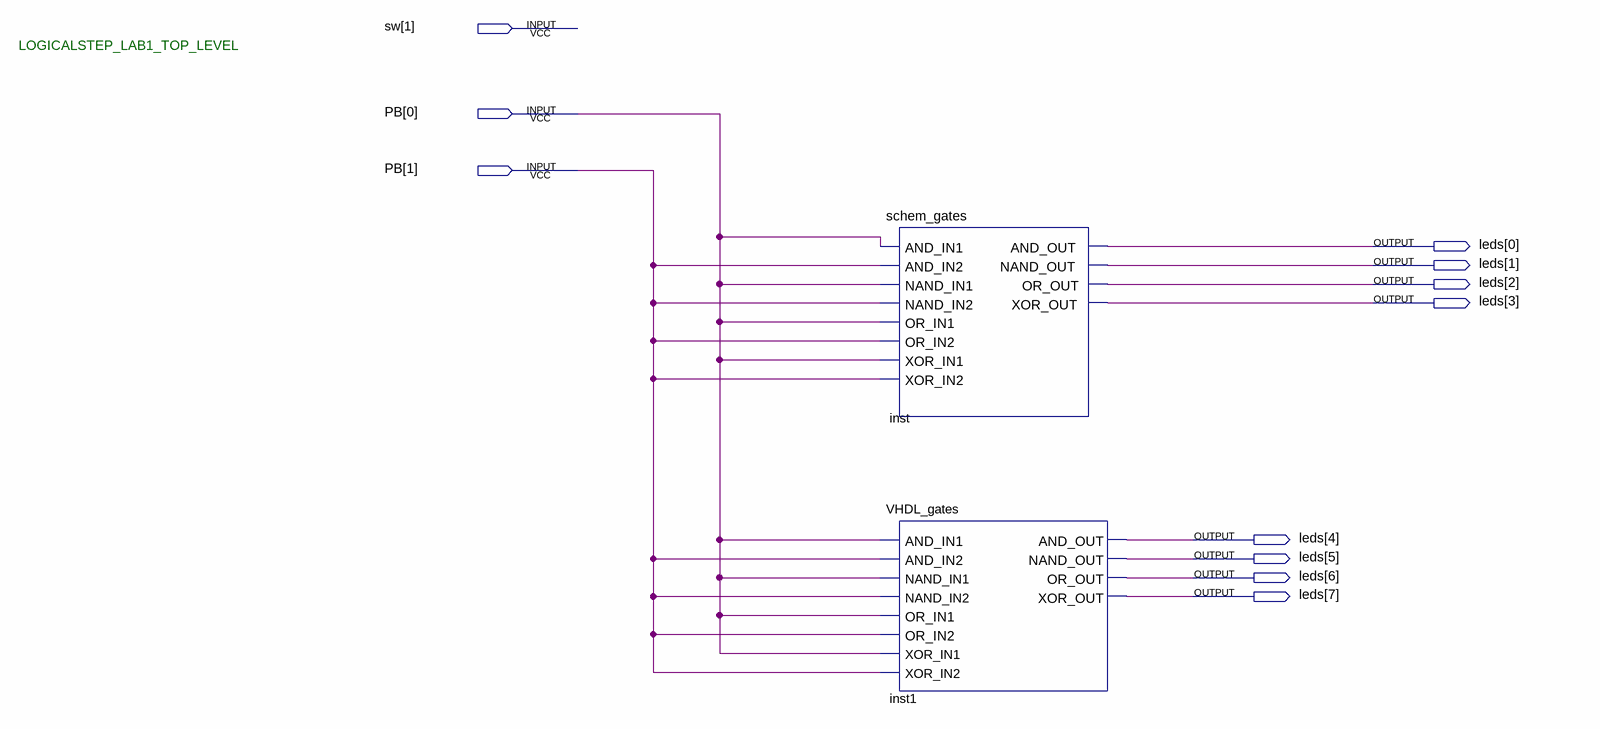
[diagram p0: schematic sheet]
// Quartus schematic LogicalStep_Lab1_top.bdf as structural Verilog: 2 symbols, 11 pins
module LogicalStep_Lab1_top (
  input  [1:1] sw,
  input  [1:0] PB,
  output [7:0] leds
);

  schem_gates inst (
    .AND_IN1(PB[0]), .AND_IN2(PB[1]), .NAND_IN1(PB[0]), .NAND_IN2(PB[1]), .OR_IN1(PB[0]), .OR_IN2(PB[1]),
    .XOR_IN1(PB[0]), .XOR_IN2(PB[1]), .AND_OUT(leds[0]), .NAND_OUT(leds[1]), .OR_OUT(leds[2]),
    .XOR_OUT(leds[3]));
  VHDL_gates inst1 (
    .AND_IN1(PB[0]), .AND_IN2(PB[1]), .NAND_IN1(PB[0]), .NAND_IN2(PB[1]), .OR_IN1(PB[0]), .OR_IN2(PB[1]),
    .XOR_IN1(PB[0]), .XOR_IN2(PB[1]), .AND_OUT(leds[4]), .NAND_OUT(leds[5]), .OR_OUT(leds[6]),
    .XOR_OUT(leds[7]));

  // Notes on the sheet:
  //   LOGICALSTEP_LAB1_TOP_LEVEL
endmodule
